# Altium schematic sheet SIMCARD_SCH.SchDoc
size A3; SheetNumber: 1; SheetTotal: 1
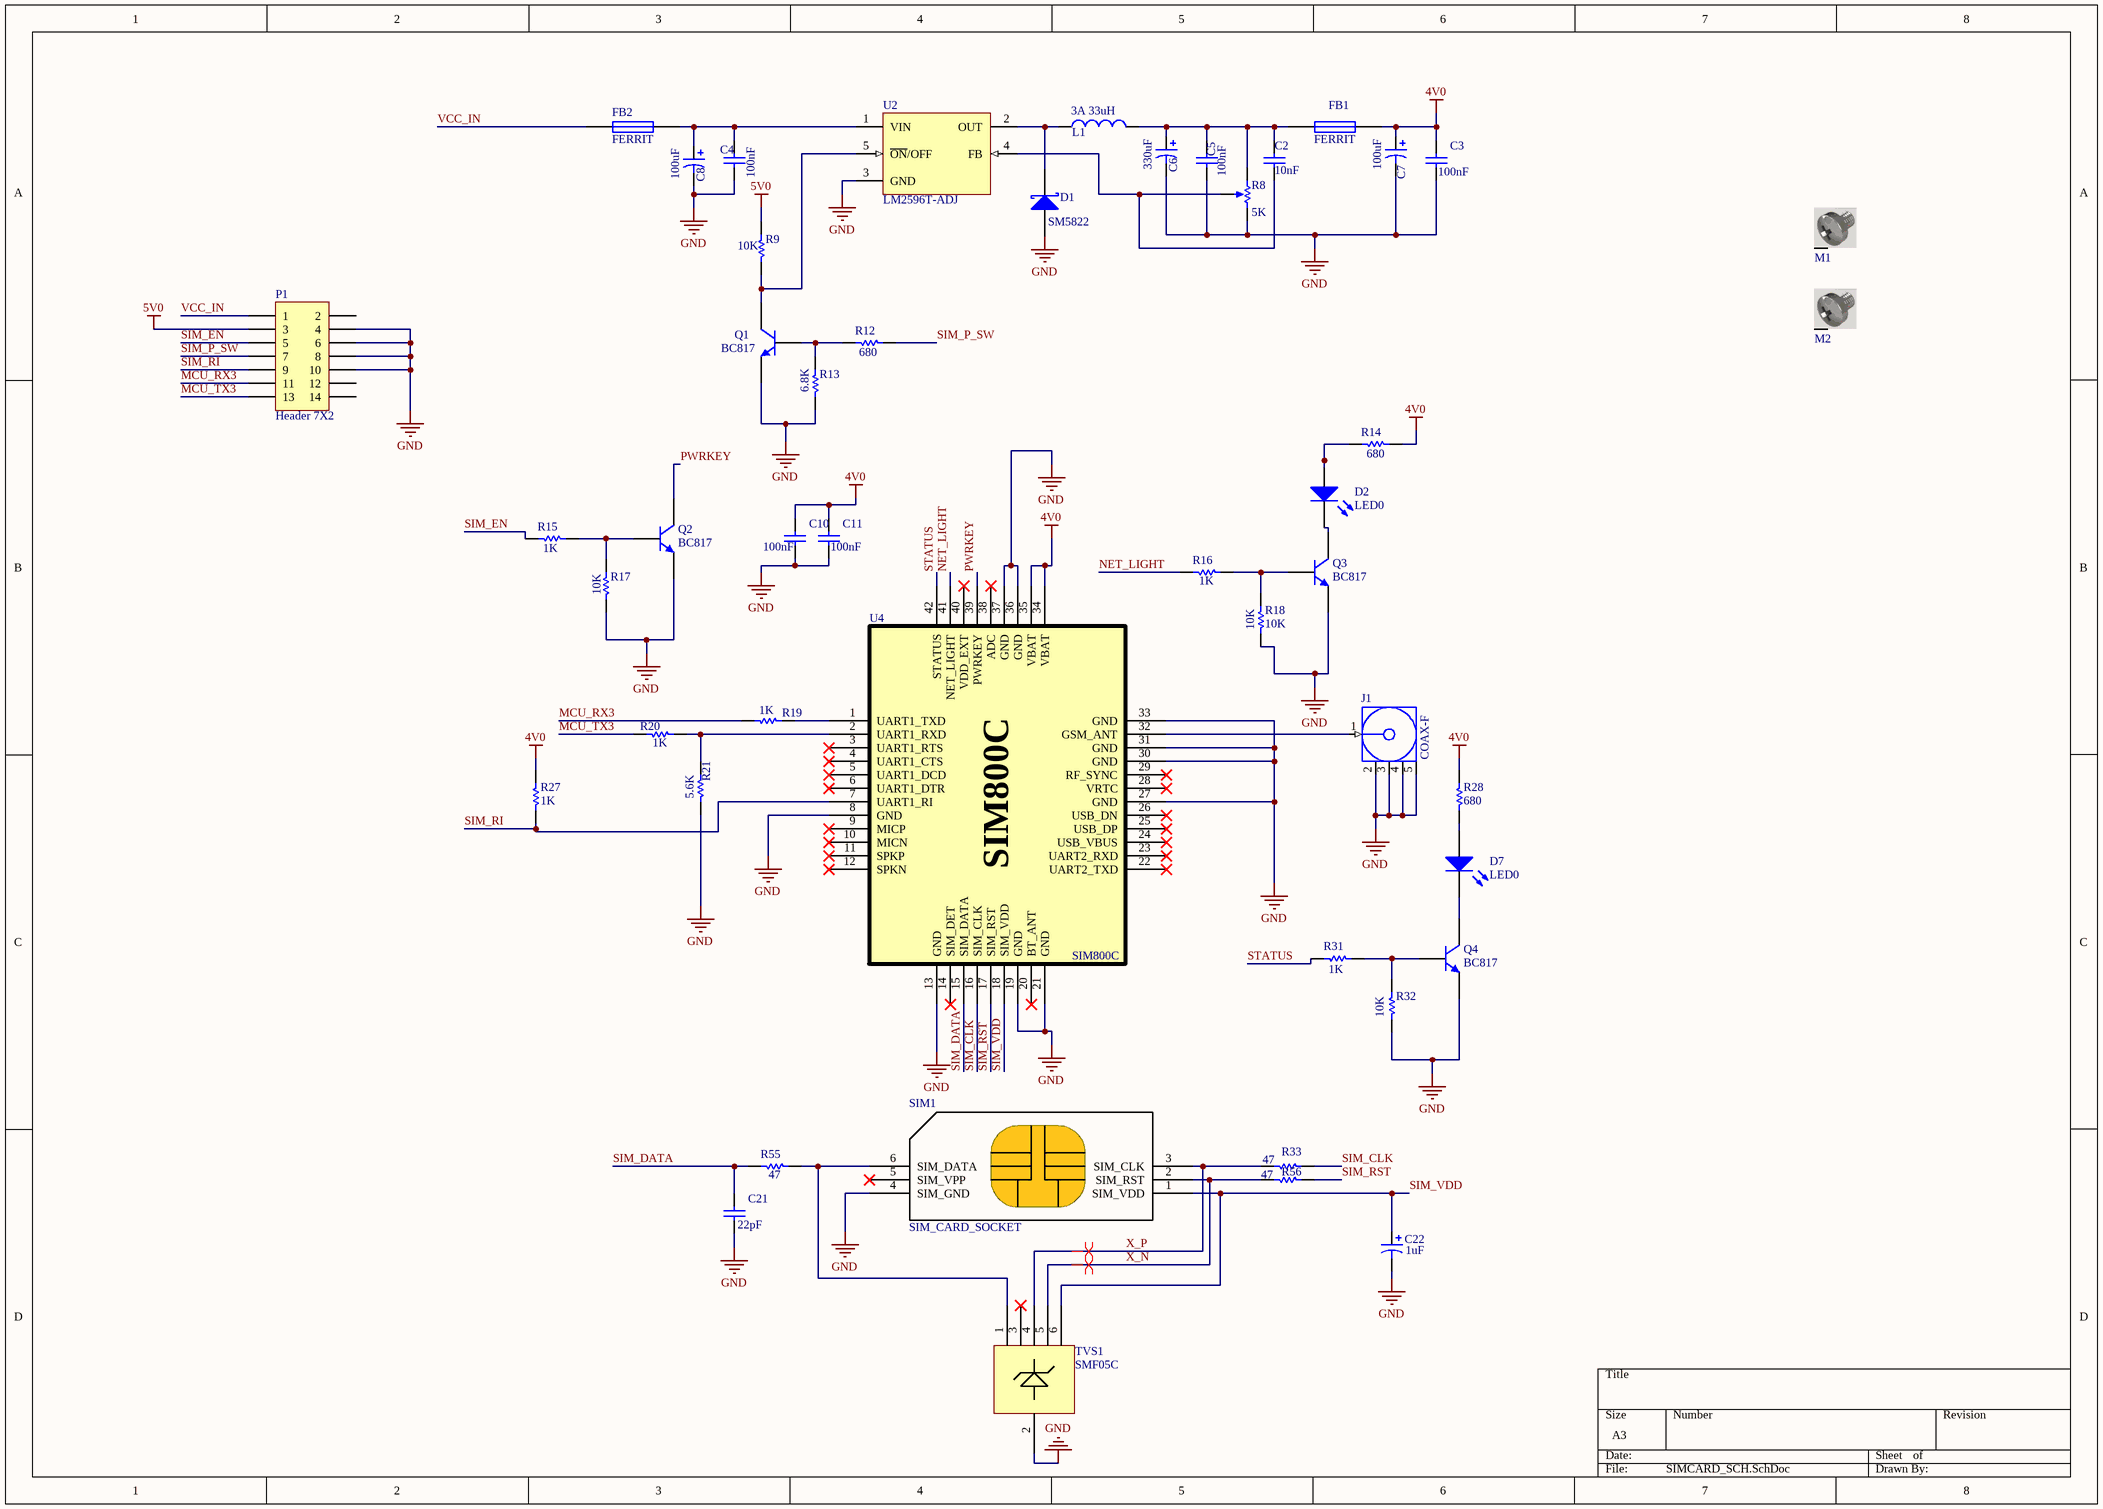
[diagram p0: SIMCARD_SCH.SchDoc]

## Parts
C2  10nF  [SMD_805]
C3  100nF  [SMD_805]
C4  100nF  [SMD_805]
C5  100nF  [SMD_805]
C6  330uF  [C_CYL_SMD]
C7  100uF  [C_B]
C8  100uF  [C_B]
C10  100nF  [SMD_805]
C11  100nF  [SMD_805]
C21  22pF  [SMD_805]
C22  1uF  [CAP_SMD_A]
D1  SM5822  [DO_214_AB_SMC]
D2  LED0  [SMD_805]
D7  LED0  [SMD_805]
FB1  FERRIT  [smd_805]
FB2  FERRIT  [smd_805]
J1  COAX-F  [SMA]
L1  33uH  Current: 3A  [INDUC_SMD]
M1  Screw  [Board Screw_No Silk]  (value not drawn)
M2  Screw  [Board Screw_No Silk]  (value not drawn)
P1  Header 7X2  [HDR2X7]
Q1  BC817  [SOT23]
Q2  BC817  [SOT23]
Q3  BC817  [SOT23]
Q4  BC817  [SOT23]
R8  value 5K  [POT]  (hidden comment: RPot)
R9  10K  [SMD_805]
R12  680  [SMD_805]
R13  6.8K  [SMD_805]
R14  680  [SMD_805]
R15  1K  [SMD_805]
R16  1K  [SMD_805]
R17  10K  [SMD_805]
R18  10K  [SMD_805]
R19  1K  [SMD_805]
R20  1K  [SMD_805]
R21  5.6K  [SMD_805]
R27  1K  [SMD_805]
R28  680  [SMD_805]
R31  1K  [SMD_805]
R32  10K  [SMD_805]
R33  47  [SMD_805]
R55  47  [SMD_805]
R56  47  [SMD_805]
SIM1  SIM_CARD_SOCKET  [SIM_CARD_HOLDER]
TVS1  SMF05C  [SMF05C_6L]
U2  LM2596T-ADJ  [LM2576_SMD]
U4  SIM800C  [SIM800C_3D]

## Nets
4V0: C3.2 C7.1 C10.2 C11.2 FB1.2 R14.2 R27.1 R28.2 U4.34(VBAT) U4.35(VBAT)
5V0: P1.3 R9.2
GND: C3.1 C4.1 C5.1 C6.2 C7.2 C8.2 C10.1 C11.1 C21.1 C22.2 D1.1(A) J1.2(GND) J1.3(GND) J1.4(GND) J1.5(GND) P1.4 P1.6 P1.8 P1.10 Q1.2(E) Q2.2(E) Q3.2(E) Q4.2(E) R8.2(BOT) R13.1 R17.2 R18.2 R21.1 R32.2 SIM1.4(SIM_GND) TVS1.2 U2.3(GND) U4.8(GND) U4.13(GND) U4.19(GND) U4.21(GND) U4.27(GND) U4.30(GND) U4.31(GND) U4.33(GND) U4.36(GND) U4.37(GND)
MCU_RX3: P1.11 R19.2
MCU_TX3: P1.13 R20.2
NET_LIGHT: R16.1 U4.41(NET_LIGHT)
PWRKEY: Q2.3(C) U4.39(PWRKEY)
SIM_CLK: R33.2 U4.16(SIM_CLK)
SIM_DATA: C21.2 R55.1 U4.15(SIM_DATA)
SIM_EN: P1.5 R15.1
SIM_P_SW: P1.7 R12.2
SIM_RI: P1.9 R27.2 U4.7(UART1_RI)
SIM_RST: R56.2 U4.17(SIM_RST)
SIM_VDD: C22.1 SIM1.1(SIM_VDD) TVS1.6 U4.18(SIM_VDD)
STATUS: R31.1 U4.42(STATUS)
VCC_IN: FB2.2 P1.1
X_N: R56.1 SIM1.2(SIM_RST) TVS1.5
X_P: R33.1 SIM1.3(SIM_CLK) TVS1.4
NetC2_1: C2.1 R8.3(TAP) U2.4(FB)
NetC2_2: C2.2 C5.2 C6.1 FB1.1 L1.2 R8.1(TOP)
NetC4_2: C4.2 C8.1 FB2.1 U2.1(VIN)
NetD1_2: D1.2(K) L1.1 U2.2(OUT)
NetD2_1: D2.1(A) R14.1
NetD2_2: D2.2(K) Q3.3(C)
NetD7_1: D7.1(A) R28.1
NetD7_2: D7.2(K) Q4.3(C)
NetJ1_1: J1.1(Signal) U4.32(GSM_ANT)
NetQ1_1: Q1.1(B) R12.1 R13.2
NetQ1_3: Q1.3(C) R9.1 U2.5(~{ON}/OFF)
NetQ2_1: Q2.1(B) R15.2 R17.1
NetQ3_1: Q3.1(B) R16.2 R18.1
NetQ4_1: Q4.1(B) R31.2 R32.1
NetR19_1: R19.1 U4.1(UART1_TXD)
NetR20_1: R20.1 R21.2 U4.2(UART1_RXD)
NetR55_2: R55.2 SIM1.6(SIM_DATA) TVS1.1

Not connected (* = marked no-connect by the designer): M1 S; M2 S; P1 2 12 14; SIM1 5(SIM_VPP)*; TVS1 3*; U4 3(UART1_RTS)* 4(UART1_CTS)* 5(UART1_DCD)* 6(UART1_DTR)* 9(MICP)* 10(MICN)* 11(SPKP)* 12(SPKN)* 14(SIM_DET)* 20(BT_ANT)* 22(UART2_TXD)* 23(UART2_RXD)* 24(USB_VBUS)* 25(USB_DP)* 26(USB_DN)* 28(VRTC)* 29(RF_SYNC)* 38(ADC)* 40(VDD_EXT)*

## Layout directives
differential pair: X_N, X_P

## Library data of the parts
C2-C5 C10 C11 C21 = Cap: Capacitor; Published: 8-Jun-2000; LatestRevisionDate: 17-Jul-2002; LatestRevisionNote: Re-released for DXP Platform.; PackageReference: RAD-0.3; Publisher: Altium Limited
  C2: Value: 10nF
  C3-C5 C10 C11: Value: 100nF
  C21: Value: 22pF
C6-C8 = Cap Pol1: Polarized Capacitor (Radial); Published: 8-Jun-2000; LatestRevisionDate: 17-Jul-2002; LatestRevisionNote: Re-released for DXP Platform.; PackageReference: RB7.6-15; Publisher: Altium Limited
  C6: Value: 330uF
  C7 C8: Value: 100uF
C22 = Cap Pol1: Polarized Capacitor (Radial); Value: 1nF; Published: 8-Jun-2000; LatestRevisionDate: 17-Jul-2002; LatestRevisionNote: Re-released for DXP Platform.; PackageReference: RB7.6-15; Publisher: Altium Limited
D1 = Diode 11DQ03: Schottky Rectifier; Published: 8-Jun-2000; LatestRevisionDate: 17-Jul-2002; LatestRevisionNote: Re-released for DXP Platform.; DatasheetVersion: Dec-1997; PackageReference: DO-204AL; Publisher: Altium Limited; Code_JEDEC: DO-204-AL; ComponentLink1Description: Manufacturer Link; ComponentLink1URL: http://www.irf.com/; ComponentLink2Description: Datasheet; ComponentLink2URL: http://www.irf.com/product-info/datasheets/data/11dq03.pdf
D2 D7 = LED0: Typical INFRARED GaAs LED; Published: 8-Jun-2000; LatestRevisionDate: 08-Jul-2005; LatestRevisionNote: Mech Layer 1 removed.; PackageReference: LED-0; Publisher: Altium Limited
FB1 FB2 = Fuse 1: Fuse; Published: 8-Jun-2000; LatestRevisionDate: 17-Jul-2002; LatestRevisionNote: Re-released for DXP Platform.; PackageReference: PIN-W2/E2.8; Publisher: Altium Limited
J1 = COAX-F: RF Coaxial PCB Connector, MCX; Thru-Hole, Right-Angle Mount Socket, Blunt Post Terminal, 50 Ohm Impedance; PCB_Layout: Complies with manufacturer's recommendation.; DrillSize: Corresponds to nominal value.; Published: 15-Jul-2004; LatestRevisionDate: 15-Jul-2004; LatestRevisionNote: Component Replaced.; DatasheetDocument: 30-May-2003; PackageDocument: 04-Jul-1999; PackageReference: 919-119J-51AX; Publisher: Altium Limited; ComponentLink1Description: Manufacturer Link; ComponentLink1URL: http://www.amphenolrf.com/
L1 = Inductor: Code_IEC: 1005; Value: 100uH; Published: 8-Jun-2000; LatestRevisionDate: 29-May-2009; LatestRevisionNote: IPC-7351 Footprint Added.; PackageReference: 0402-A; Publisher: Altium Limited; PackageDescription: Chip Inductor; Code_JEITA: 0402
M1 M2 = Board Screw: Board Screw With Spacer
P1 = Header 7X2: Header, 7-Pin, Dual row; LatestRevisionDate: 17-Jul-2002; LatestRevisionNote: Re-released for DXP Platform.; Publisher: Altium Limited
Q1 = NPN: NPN Bipolar Transistor; Published: 8-Jun-2000; LatestRevisionDate: 17-Jul-2002; LatestRevisionNote: Re-released for DXP Platform.; PackageReference: TO-226; Publisher: Altium Limited; Code_JEDEC: TO-226-AA
Q2-Q4 = 2N3904: NPN General Purpose Amplifier; Published: 8-Jun-2000; LatestRevisionDate: 15-Jan-2003; LatestRevisionNote: PCB Footprint 'BCY-W3/D4.7' replaced; DatasheetVersion: 1997; PackageVersion: Sep-1998; PackageReference: TO-92A; Publisher: Altium Limited; Code_JEDEC: TO-92A; ComponentLink1Description: Manufacturer Link; ComponentLink1URL: http://www.fairchildsemi.com/; ComponentLink2Description: Datasheet; ComponentLink2URL: http://www.fairchildsemi.com/ds/2N%2F2N3904.pdf
R8 = RPot: Potentiometer; Sim Note: Enter the Resistance value and the set point into parameter fields.; Set Position: 0.5; Published: 8-Jun-2000; LatestRevisionDate: 17-Jul-2002; LatestRevisionNote: Re-released for DXP Platform.; PackageReference: VR5; Publisher: Altium Limited
R9 R12-R21 R27 R28 R31-R33 R55 R56 = Res1: Resistor; Published: 8-Jun-2000; LatestRevisionDate: 17-Jul-2002; LatestRevisionNote: Re-released for DXP Platform.; PackageReference: AXIAL-0.3; Publisher: Altium Limited
  R9 R17 R18 R32: Value: 10K
  R12 R14 R28: Value: 680
  R13: Value: 6.8K
  R15 R16 R19 R20 R27 R31: Value: 1K
  R21: Value: 5.6K
  R33 R55 R56: Value: 47
TVS1 = TVS_ARRAY
U2 = LM2596T-ADJ: SIMPLE SWITCHER Power Converter 150 KHz 3A Step-Down Voltage Regulator; Manufacturer: National Semiconductor; PackageTopMarking: NSUZXYTT*LM2596T*-ADJ P+; PowerWise: N; Published: 4-Dec-2008; DatasheetVersion: May-2002; PackageVersion: revA, Oct-1989; PackageReference: T05D; Publisher: Altium Limited; PackageDescription: TO-220, Molded, Stagger Bend, 5 Lead; CompType: Switcher; PartNumber: LM2596T-ADJ; RoHS: O; PinCount: 5; DigiKeyPartNumber: LM2596T-ADJ-ND; ComponentLink1Description: LM2596 Datasheet; ComponentLink1URL: http://www.national.com/ds/LM/LM2596.pdf; ComponentLink2Description: LM2596 Web Page; ComponentLink2URL: http://www.national.com/pf/LM/LM2596.html; ComponentLink3Description: T05D Package Page; ComponentLink3URL: http://www.national.com/packaging/folders/t05d.html